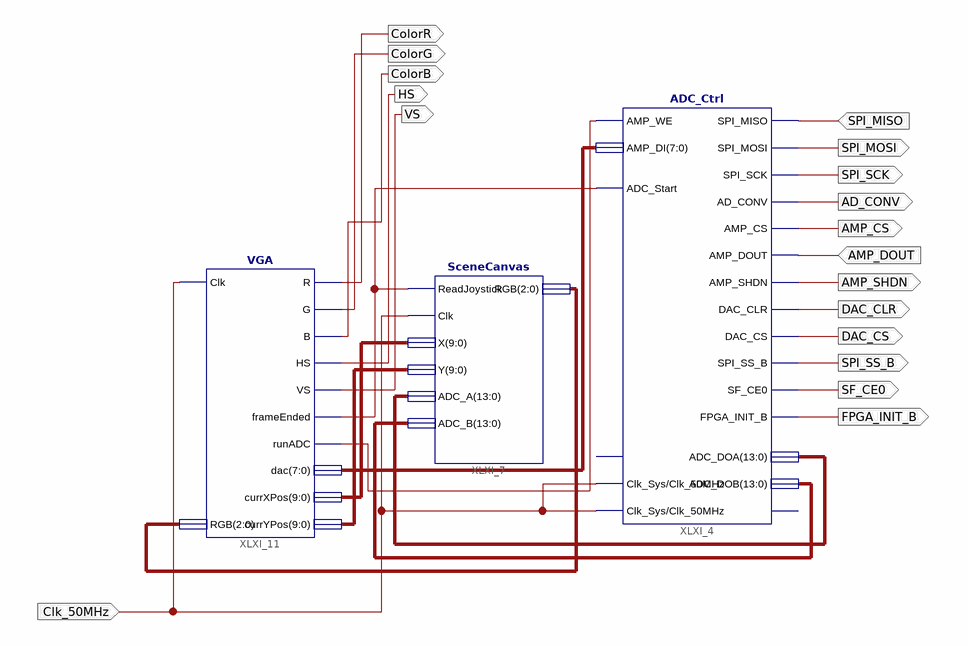
[diagram p0: schematic sheet 1]
// Xilinx ISE schematic schema.sch (spartan3e) as structural Verilog: 3 symbols, 18 ports
module schema (
  input  AMP_DOUT,
  input  SPI_MISO,
  input  Clk_50MHz,
  output ColorR,
  output ColorG,
  output ColorB,
  output HS,
  output VS,
  output FPGA_INIT_B,
  output SF_CE0,
  output SPI_SS_B,
  output DAC_CS,
  output DAC_CLR,
  output AMP_SHDN,
  output AMP_CS,
  output AD_CONV,
  output SPI_SCK,
  output SPI_MOSI
);

  wire XLXN_209, XLXN_210;
  wire [2:0] XLXN_217;
  wire [7:0] XLXN_211;
  wire [9:0] XLXN_212, XLXN_213;
  wire [13:0] XLXN_201, XLXN_202;

  ADC_Ctrl XLXI_4 (
    .Clk_Sys(Clk_50MHz), .AMP_WE(XLXN_210), .ADC_Start(XLXN_209), .SPI_MISO(SPI_MISO), .AMP_DOUT(AMP_DOUT),
    .AMP_DI(XLXN_211), .SPI_MOSI(SPI_MOSI), .SPI_SCK(SPI_SCK), .AMP_CS(AMP_CS), .AMP_SHDN(AMP_SHDN),
    .AD_CONV(AD_CONV), .DAC_CS(DAC_CS), .DAC_CLR(DAC_CLR), .SPI_SS_B(SPI_SS_B), .SF_CE0(SF_CE0),
    .FPGA_INIT_B(FPGA_INIT_B), .ADC_DOA(XLXN_201), .ADC_DOB(XLXN_202), .Clk_50MHz(Clk_50MHz));  // open: Busy, Reset
  SceneCanvas XLXI_7 (
    .ReadJoystick(XLXN_209), .Clk(Clk_50MHz), .X(XLXN_212), .Y(XLXN_213), .ADC_A(XLXN_201), .ADC_B(XLXN_202),
    .RGB(XLXN_217));
  VGA XLXI_11 (
    .Clk(Clk_50MHz), .RGB(XLXN_217), .R(ColorR), .G(ColorG), .B(ColorB), .HS(HS), .VS(VS),
    .frameEnded(XLXN_209), .runADC(XLXN_210), .dac(XLXN_211), .currXPos(XLXN_212), .currYPos(XLXN_213));
endmodule
